# EAGLE design LeftSensor (EAGLE 9.1.3)
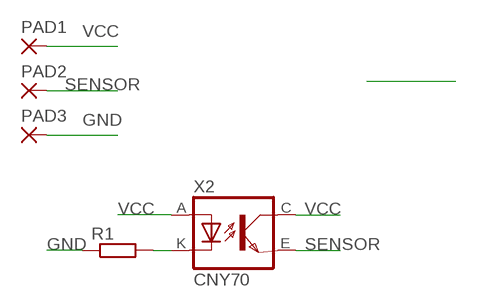
[diagram p0: schematic, sheet 1]

## Parts
PAD1  WIREPADSMD1,27-254  [SMD1,27-2,54]
PAD2  WIREPADSMD1,27-254  [SMD1,27-2,54]
PAD3  WIREPADSMD1,27-254  [SMD1,27-2,54]
R1  RCL_R-EU_R0805  [RCL_R0805]
X2  CNY70  [4]

## Nets
GND: PAD3.1(P) R1.1
N$1: R1.2 X2.K(C)
SENSOR: PAD2.1(P) X2.E(EMI)
VCC: PAD1.1(P) X2.A X2.C(COL)

## Library data of the parts
PAD1-PAD3 = wirepad:WIREPAD: Wire PAD connect wire on PCB
R1 = ScyllAlarmV3.0:RCL_R-EU_: RESISTOR, European symbol
X2 = cny70:CNY70

## Board
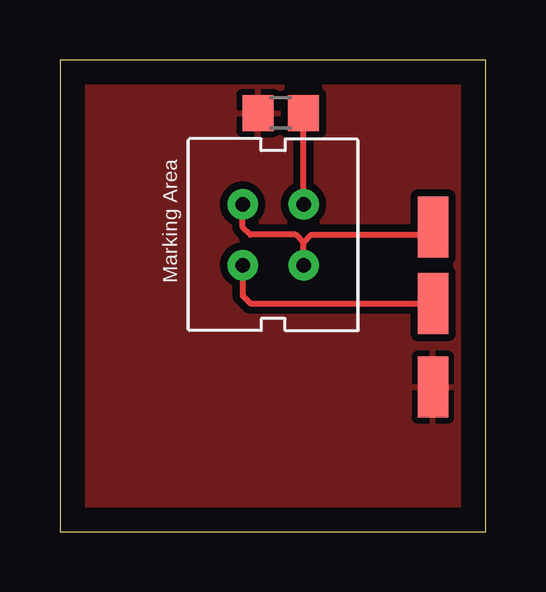
[diagram p1: board, top side]

Size 17.76 x 19.67 mm. Coordinates in mm from the lower left corner, seen from the top.
Outline: 0,0 17.76,0 17.76,19.67 0,19.67 0,0
Copper layers (1*16): Top 0.035mm / dielectric 1.5mm / Bottom 0.035mm
Design rules "default": minimum track width 6mil, minimum drill 0.35mm, track to track 6mil, track to pad 6mil, pad to pad 6mil, via to via 6mil, smd to smd 6mil, copper to edge 40mil, drill to drill 6mil, minimum pad ring 10mil, minimum via ring 8mil, stop-mask expansion 4mil, vias tented up to drill 0mil, thermal gap 10mil

### Footprints (pad centres in the part's own frame; a part is rotated, then mirrored left to right if it is on the bottom)
SMD1,27-2,54 = smd 1.27 x 2.54: 1 0,0
RCL_R0805 = smd 1.3 x 1.5: 1 -0.95,0; 2 0.95,0
4 = drill 0.61 pad 1.27: A -1.27,1.27; C 1.27,-1.27; E 1.27,1.27; K -1.27,-1.27

### Placement (x,y rotation side)
PAD1  15.56,12.7 0 top
PAD2  15.56,9.53 0 top
PAD3  15.56,6.03 0 top
R1  9.21,17.46 0 top
X2  8.89,12.38 180 top

### Tracks (layer width: path | path; a pad name or v marks a point on that pad's centre or on a via)
GND
  pour Top (isolate 0.305): 0,19.68 17.78,19.68 17.78,0 0,0
N$1
  Top 0.254: R1.2 X2.K
SENSOR
  Top 0.254: X2.E 7.62,9.84 7.94,9.53 PAD2.1
VCC
  Top 0.254: X2.A 10.16,12.06 | 10.16,12.06 9.84,12.38 7.94,12.38 7.62,12.7 X2.C | 10.16,12.06 | 10.16,12.06 10.48,12.38 15.24,12.38 PAD1.1